# Altium schematic sheet OSU_LVUP.SchDoc
size A4
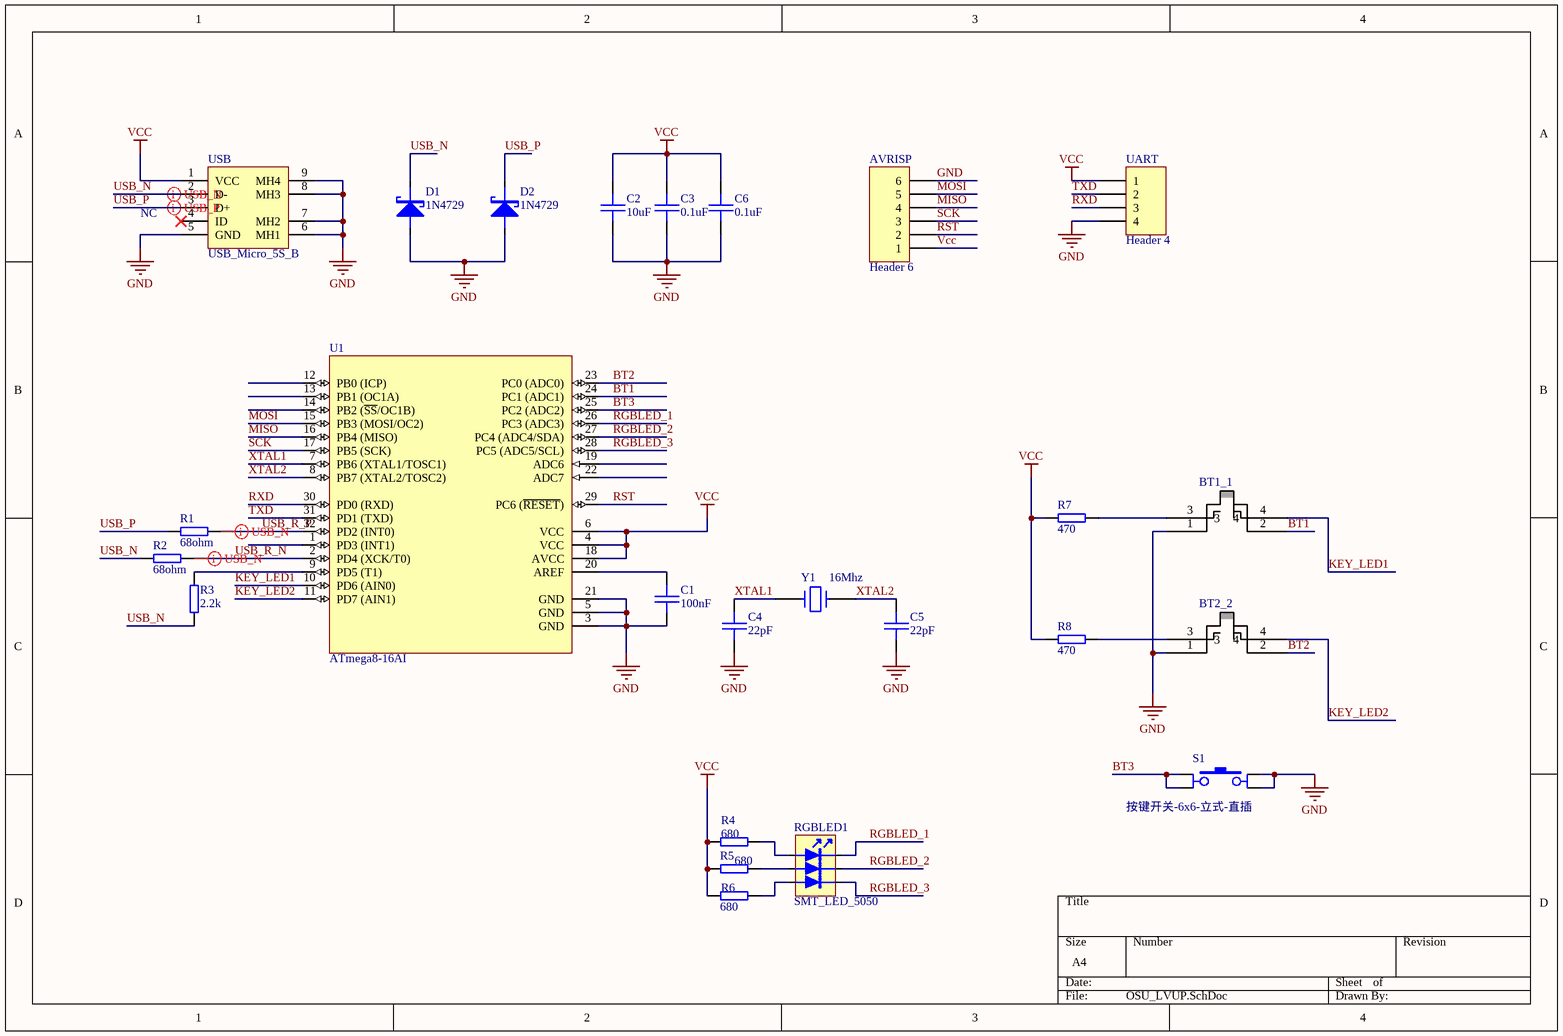
[diagram p0: OSU_LVUP.SchDoc]

## Parts
AVRISP  Header 6  [THT_Male_P_1x6-2.54mm]
BT1_1  Cherry_MX  [cherry_mx]  (value not drawn)
BT2_2  JiXieJianPian  [cherry_mx]  (value not drawn)
C1  100nF  [SMT_C_0805]
C2  10uF  [SMT_C_0805]
C3  0.1uF  [SMT_C_0805]
C4  22pF  [SMT_C_0805]
C5  22pF  [SMT_C_0805]
C6  0.1uF  [SMT_C_0805]
D1  1N4729  [SMT_DIODE_SOD_123]
D2  1N4729  [SMT_DIODE_SOD_123]
R1  68ohm  [SMT_R_0805]
R2  68ohm  [SMT_R_0805]
R3  2.2k  [SMT_R_0805]
R4  680  [SMT_R_0805]
R5  680  [SMT_R_0805]
R6  680  [SMT_R_0805]
R7  470  [SMT_R_0805]
R8  470  [SMT_R_0805]
RGBLED1  SMT_LED_5050  [SMT_LED_5050]
S1  按键开关-6x6-立式-直插  [按键开关-6x6-立式-直插]
U1  ATmega8-16AI  [32A_N]
UART  Header 4  [HDR1X4]
USB  USB_Micro_5S_B  [USB_MICRO_5S_B]
Y1  16Mhz  [晶振-HC49S]

## Nets
GND: AVRISP.6 BT1_1.1 BT2_2.1 C1.2 C2.2 C3.2 C4.2 C5.2 C6.2 D1.1(A) D2.1(A) S1.3(PINB1) S1.4(PINB2) U1.3(GND) U1.5(GND) U1.21(GND) UART.4 USB.5(GND) USB.6(MH1) USB.7(MH2) USB.8(MH3) USB.9(MH4)
Vcc: AVRISP.1 C2.1 C3.1 C6.1 R4.1 R5.1 R6.1 R7.1 R8.1 U1.4(VCC) U1.6(VCC) U1.18(AVCC) UART.1 USB.1(VCC)
BT1: BT1_1.2 U1.24(PC1_(ADC1))
BT2: BT2_2.2 U1.23(PC0_(ADC0))
BT3: S1.1(PINA1) S1.2(PINA2) U1.25(PC2_(ADC2))
KEY_LED1: BT1_1.4 U1.10(PD6_(AIN0))
KEY_LED2: BT2_2.4 U1.11(PD7_(AIN1))
MISO: AVRISP.4 U1.16(PB4_(MISO))
MOSI: AVRISP.5 U1.15(PB3_(MOSI/OC2))
RGBLED_1: RGBLED1.3(K3) U1.26(PC3_(ADC3))
RGBLED_2: RGBLED1.2(K2) U1.27(PC4_(ADC4/SDA))
RGBLED_3: RGBLED1.1(K1) U1.28(PC5_(ADC5/SCL))
RST: AVRISP.2 U1.29(PC6_(~{RESET}))
RXD: U1.30(PD0_(RXD)) UART.3
SCK: AVRISP.3 U1.17(PB5_(SCK))
TXD: U1.31(PD1_(TXD)) UART.2
USB_N: D1.2(K) R2.1 R3.2 USB.2(D-)
USB_P: D2.2(K) R1.1 USB.3(D+)
USB_R_N: R2.2 U1.2(PD4_(XCK/T0))
USB_R_P: R1.2 U1.32(PD2_(INT0))
XTAL1: C4.1 U1.7(PB6_(XTAL1/TOSC1)) Y1.1
XTAL2: C5.1 U1.8(PB7_(XTAL2/TOSC2)) Y1.2
NetBT1_1_3: BT1_1.3 R7.2
NetBT2_2_3: BT2_2.3 R8.2
NetC1_1: C1.1 U1.20(AREF)
NetR3_1: R3.1 U1.9(PD5_(T1))
NetR4_2: R4.2 RGBLED1.4(A3)
NetR5_2: R5.2 RGBLED1.5(A2)
NetR6_2: R6.2 RGBLED1.6(A1)

Not connected (* = marked no-connect by the designer): U1 1(PD3_(INT1)) 12(PB0_(ICP)) 13(PB1_(OC1A)) 14(PB2_(~{SS}/OC1B)) 19(ADC6) 22(ADC7); USB 4(ID)*

## Layout directives
differential pair: USB_N, USB_P, USB_R_N, USB_R_P

## Notes on the sheet
- NC

## Library data of the parts
AVRISP = Header 6: Header, 6-Pin; LatestRevisionDate: 17-Jul-2002; LatestRevisionNote: Re-released for DXP Platform.; Publisher: Altium Limited
BT1_1 = JiXieJianPian
C1 C4 C5 = SMT_C_0402: Surface mount capacitor 0402
C2 C3 C6 = SMT_C_0805: Surface mount capacitor 0805
D1 D2 = SMT_DIODE_SCHOTTKY_SOD_323: Surface mount schottky diode SOD-323(0805) Package
R1 R2 = SMT_R_0805: Surface mount resistor 0805
R3-R8 = SMT_R_0402: Surface mount resistor 0402
RGBLED1 = SMT_LED_5050: SMT LED
U1 = ATmega8-16AI: 8-Bit AVR Microcontroller with 8K Bytes of In-System Programmable Flash Memory; Published: 17-Sep-2003; LatestRevisionDate: 13-Apr-2006; LatestRevisionNote: IPC-7351 Footprint Added.; DatasheetVersion: 2486H-AVR-09/02; PackageVersion: revB, Oct-2001; PackageReference: 32A; Publisher: Altium Limited; PackageDescription: 32-Pin Thin Quad Flat Pack 0.8 mm Pitch; Code_JEDEC: MS-026-ABA; ComponentLink1Description: Manufacturer Link; ComponentLink1URL: http://www.atmel.com; ComponentLink2Description: Datasheet; ComponentLink2URL: http://www.atmel.com/dyn/resources/prod_documents/doc2486.pdf
UART = Header 4: Header, 4-Pin; LatestRevisionDate: 17-Jul-2002; LatestRevisionNote: Re-released for DXP Platform.; Publisher: Altium Limited
USB = USB_Micro_5S_B: USB micro female SMT with 4 fixed foot
Y1 = 晶振